# Altium schematic sheet Anya_2620_V1_I1.SchDoc
size A4; SheetNumber: 2; SheetTotal: 9
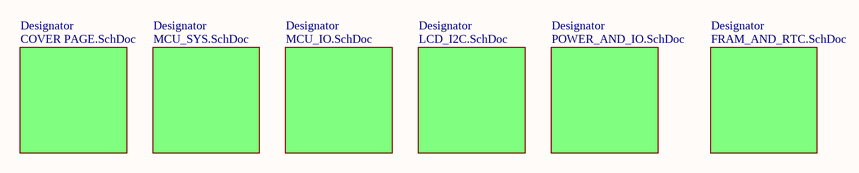
[diagram p0: Anya_2620_V1_I1.SchDoc]

## Sub-sheets
Designator = COVER PAGE.SchDoc: no entries
Designator = MCU_SYS.SchDoc: no entries
Designator = LCD_I2C.SchDoc: no entries
Designator = POWER_AND_IO.SchDoc: no entries
Designator = FRAM_AND_RTC.SchDoc: no entries
Designator = MCU_IO.SchDoc: no entries